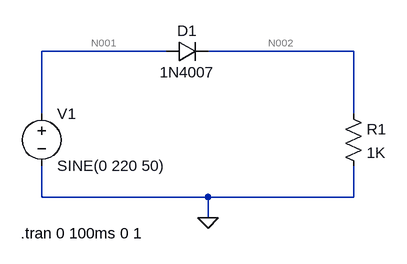
[diagram p0: schematic HalfWave.asc]
HalfWave.asc, the LTspice schematic file:
Version 4.1
SHEET 1 880 680
WIRE 80 -48 -112 -48
WIRE 368 -48 144 -48
WIRE -112 48 -112 -48
WIRE 368 48 368 -48
WIRE -112 176 -112 128
WIRE 144 176 -112 176
WIRE 368 176 368 128
WIRE 368 176 144 176
WIRE 144 208 144 176
FLAG 144 208 0
SYMBOL voltage -112 32 R0
WINDOW 123 0 0 Left 0
WINDOW 39 0 0 Left 0
SYMATTR InstName V1
SYMATTR Value SINE(0 220 50)
SYMBOL diode 80 -32 R270
WINDOW 0 32 32 VTop 2
WINDOW 3 0 32 VBottom 2
SYMATTR InstName D1
SYMATTR Value 1N4007
SYMBOL res 352 32 R0
SYMATTR InstName R1
SYMATTR Value 1K
TEXT -144 232 Left 2 !.tran 0 100ms 0 1

The netlist it stands for:
* HalfWave.asc
V1 N001 0 SINE(0 220 50)
D1 N001 N002 1N4007
R1 N002 0 1K
.model D D
.lib standard.dio
.tran 0 100ms 0 1
.backanno
.end

* Results of the author's LTspice run, read from the files saved beside the schematic
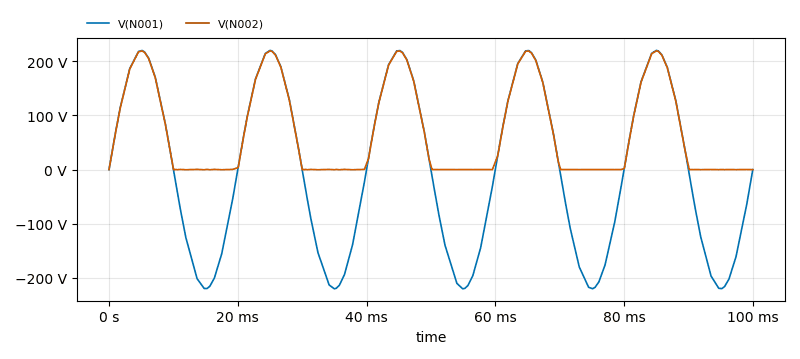
[diagram p1: Transient Analysis of HalfWave.asc, plotted from the saved traces]
* Transient Analysis, 1 run:
*   V(N001): min -220 V, max 220 V, average 93.86 mV, rms 155.6 V, last 0 V
*   V(N002): min -319 mV, max 219.2 V, average 69.04 V, rms 109.4 V, last -150 mV